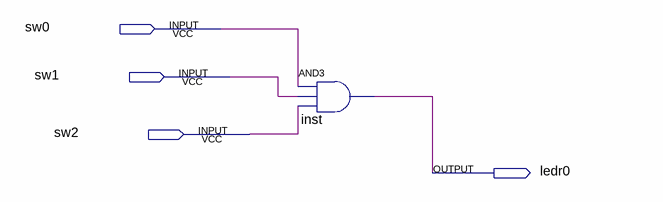
[diagram p0: schematic sheet]
// Quartus schematic and3in.bdf as structural Verilog: 1 symbols, 4 pins
module and3in (
  input  sw0,
  input  sw1,
  input  sw2,
  output ledr0
);

  and inst (ledr0, sw0, sw1, sw2);
endmodule
